# EAGLE design MainCircuit (EAGLE 6.6.0)

## Sheet 1 of 4
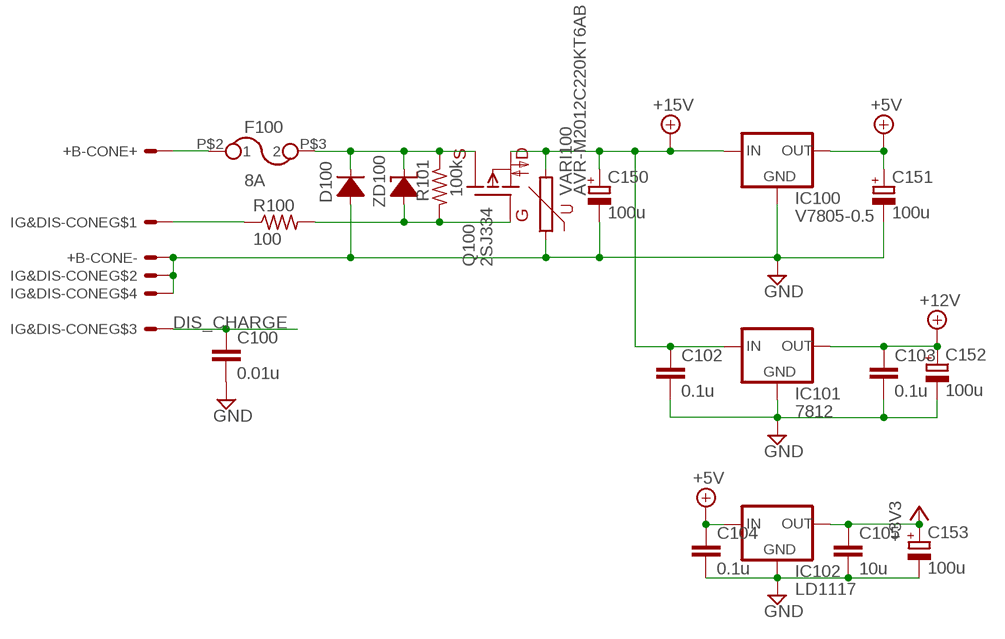
[diagram p0: schematic, sheet 1]

### Parts
+B-CONE  XT60  [XT60]
C100  0.01u  CC1608  [C1608]
C102  0.1u  CC1608  [C1608]
C103  0.1u  CC1608  [C1608]
C104  0.1u  CC1608  [C1608]
C105  10u  CC2012  [C2012]
C150  100u  CPOLE2.5-6  [E2,5-6]
C151  100u  CPOLE2.5-6  [E2,5-6]
C152  100u  CPOLE2.5-6  [E2,5-6]
C153  100u  CPOLE2.5-6  [E2,5-6]
D100  DIODEDO214  [DO214AC]
FUSE  8A  FUSE  [3216]
IC100  V7805-0.5  [V7805-0.5]
IC101  7812  78XXS  [78XXS]
IC102  LD1117  [SOT223]
IG&DIS-CONE  4B-XH-AB4B  [B4B-XH-A]
Q100  2SJ334  PCH  [TO220V]
R100  100  R-US_R1608  [R1608]
R101  100k  R-US_R1608  [R1608]
VARI100  AVR-M2012C220KT6AB  VARISTOR2012  [2012]
ZD100  ZDIODEDO214AC  [DO214AC]

### Nets
+3V3: C105.1 C153.+ IC102.2(OUT) ; also sheet 2,4
+5V: C104.1 C151.+ IC100.+VOUT(OUT) IC102.3(IN) ; also sheet 2,4
+12V: C103.1 C152.+ IC101.OUT ; also sheet 2
+15V: C102.1 C150.+ IC100.+VIN(IN) IC101.IN Q100.D VARI100.2 ; also sheet 2,3,4
DIS_CHARGE: C100.1 IG&DIS-CONE.3 ; also sheet 2
GND: +B-CONE.- C100.2 C102.2 C103.2 C104.2 C105.2 C150.- C151.- C152.- C153.- D100.A IC100.GND IC101.GND IC102.1(GND) IG&DIS-CONE.2 IG&DIS-CONE.4 VARI100.1 ; also sheet 2,3,4
N$4: IG&DIS-CONE.1 R100.1
N$11: +B-CONE.+ FUSE.P$2
N$23: D100.C FUSE.P$3 Q100.S R101.1 ZD100.C(K)
N$45: Q100.G R100.2 R101.2 ZD100.A

## Sheet 2 of 4
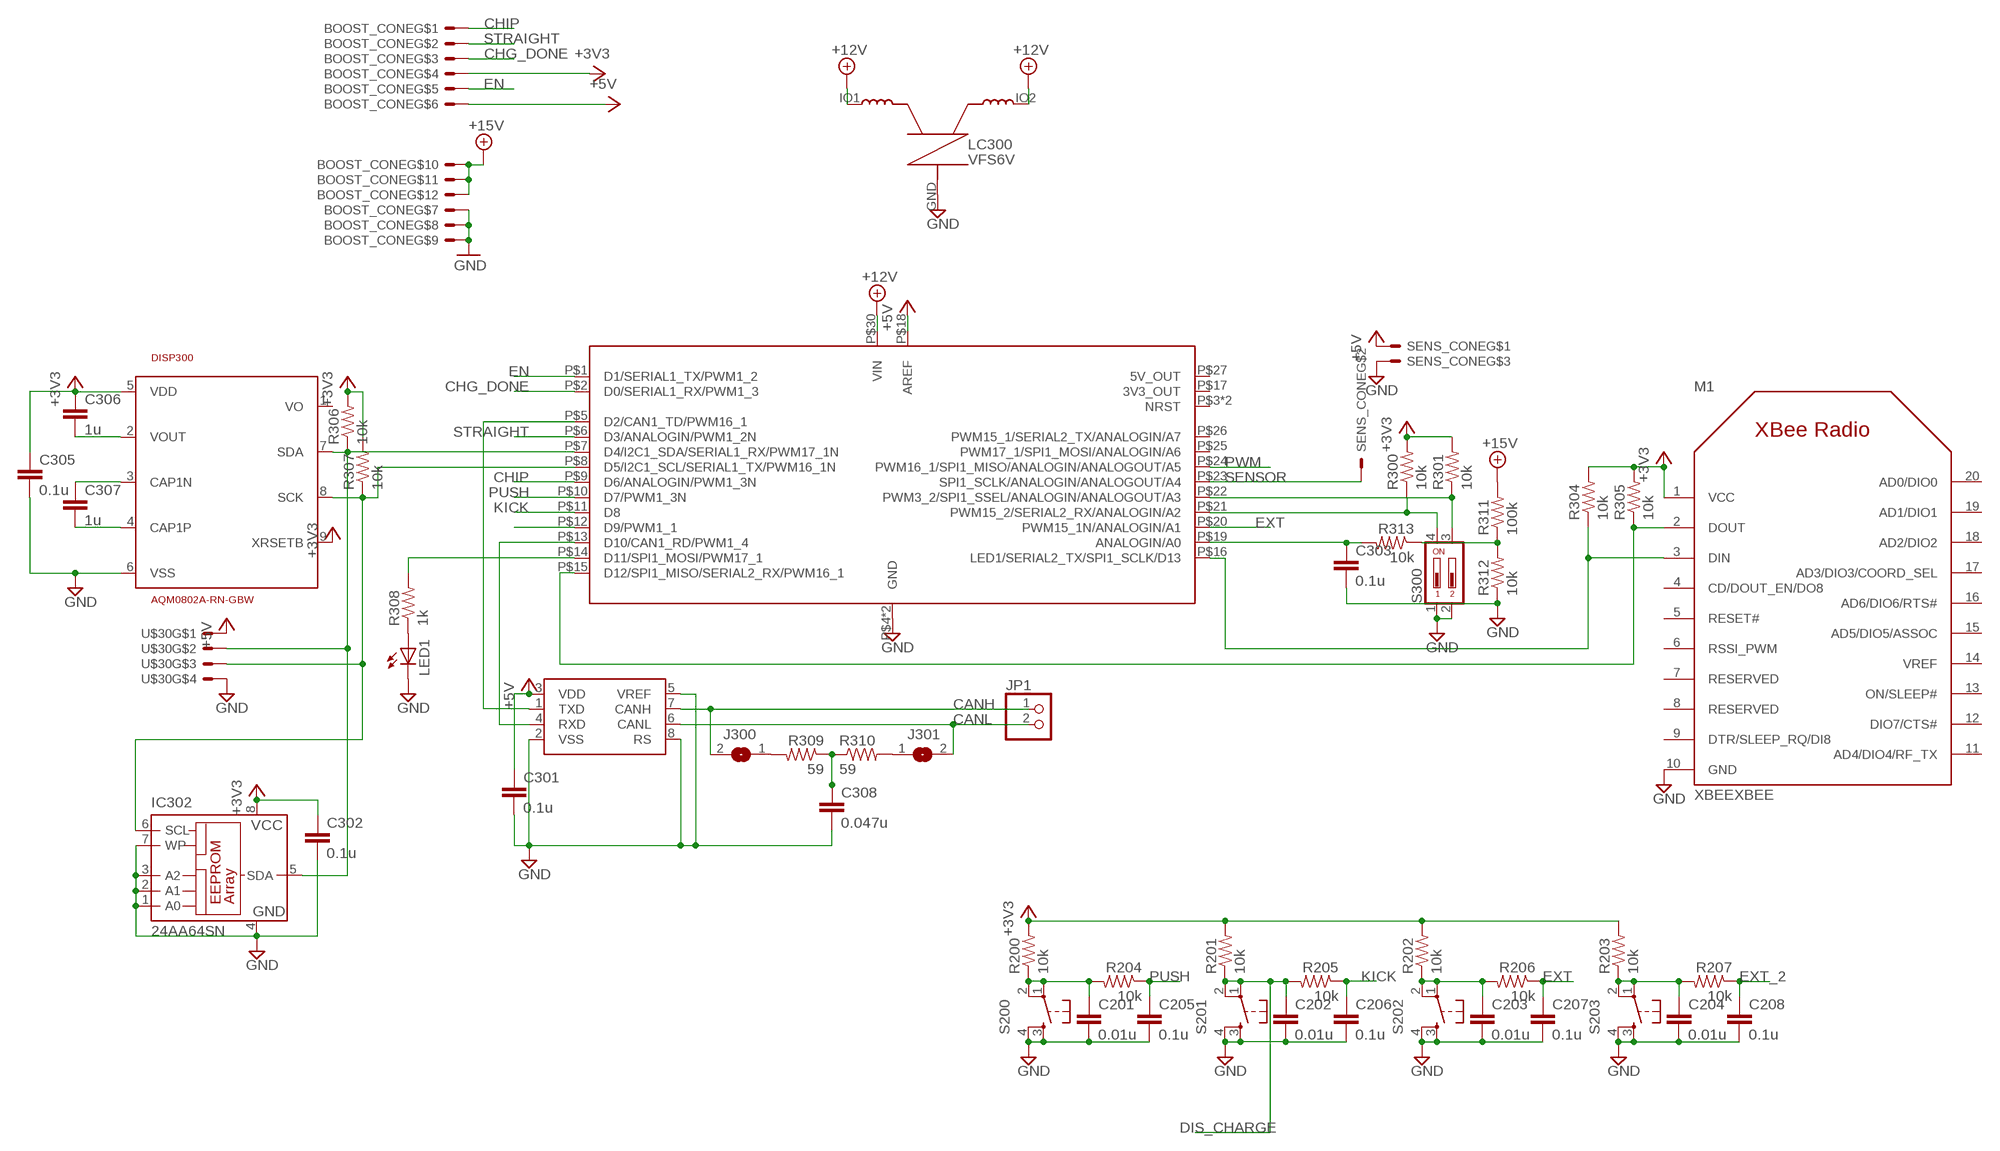
[diagram p1: schematic, sheet 2]

### Parts
BOOST_CONE  12B-XH-AB12B  [B12B-XH-A]
C201  0.01u  CC1608  [C1608]
C202  0.01u  CC1608  [C1608]
C203  0.01u  CC1608  [C1608]
C204  0.01u  CC1608  [C1608]
C205  0.1u  CC1608  [C1608]
C206  0.1u  CC1608  [C1608]
C207  0.1u  CC1608  [C1608]
C208  0.1u  CC1608  [C1608]
C301  0.1u  CC1608  [C1608]
C302  0.1u  CC1608  [C1608]
C303  0.1u  CC1608  [C1608]
C305  0.1u  CC1608  [C1608]
C306  1u  CC1608  [C1608]
C307  1u  CC1608  [C1608]
C308  0.047u  CC1608  [C1608]
DISP300  AQM0802A-RN-GBW  [AQM0802A-RN-GBW]
IC300  NUCLEO-F303K8  [NUCLEO-32]
IC301  MCP2551  [SOIC-8]
IC302  24AA64SN  [SO-08]
J300  SJ  [SJ]
J301  SJ  [SJ]
JP1  PINHD-1X2  [1X02]
LC300  VFS6V  [VFS6V]
LED1  LED3MM  [LED3MM]
M1  XBEEXBEE  [XBEE]
R200  10k  R-US_R1608  [R1608]
R201  10k  R-US_R1608  [R1608]
R202  10k  R-US_R1608  [R1608]
R203  10k  R-US_R1608  [R1608]
R204  10k  R-US_R1608  [R1608]
R205  10k  R-US_R1608  [R1608]
R206  10k  R-US_R1608  [R1608]
R207  10k  R-US_R1608  [R1608]
R300  10k  R-US_R1608  [R1608]
R301  10k  R-US_R1608  [R1608]
R304  10k  R-US_R1608  [R1608]
R305  10k  R-US_R1608  [R1608]
R306  10k  R-US_R1608  [R1608]
R307  10k  R-US_R1608  [R1608]
R308  1k  R-US_R1608  [R1608]
R309  59  R-US_R1608  [R1608]
R310  59  R-US_R1608  [R1608]
R311  100k  R-US_R1608  [R1608]
R312  10k  R-US_R1608  [R1608]
R313  10k  R-US_R1608  [R1608]
S200  T-SWITCH  [B3F-10XXS]
S201  T-SWITCH  [B3F-10XXS]
S202  T-SWITCH  [B3F-10XXS]
S203  T-SWITCH  [B3F-10XXS]
S300  DIP02YL  [DIP02YL]
SENS_CONE  3B-XH-AB3B  [B3B-XH-A]
U$30  4B-XH-AB4B  [B4B-XH-A]

### Nets
+3V3: BOOST_CONE.4 C302.1 C305.1 C306.1 DISP300.5(VDD) DISP300.9(XRSETB) IC302.8(VCC) M1.1(VCC) R200.2 R201.2 R202.2 R203.2 R300.2 R301.2 R304.2 R305.2 R306.2 R307.2 ; also sheet 1,4
+5V: BOOST_CONE.6 C301.1 IC300.P$18(AREF) IC301.3(VDD) SENS_CONE.1 U$30.1 ; also sheet 1,4
+12V: LC300.IO1 ; also sheet 1
+12V": IC300.P$30(VIN) LC300.IO2 ; supply symbol labelled +12V
+15V: BOOST_CONE.10 BOOST_CONE.11 BOOST_CONE.12 R311.2 ; also sheet 1,3,4
CANH: IC301.7(CANH) J300.2 JP1.1 ; also sheet 4
CANL: IC301.6(CANL) J301.2 JP1.2 ; also sheet 4
CHG_DONE: BOOST_CONE.3 IC300.P$2(D0/SERIAL1_RX/PWM1_3)
CHIP: BOOST_CONE.1 IC300.P$9(D6/ANALOGIN/PWM1_3N)
DIS_CHARGE: C202.1 R201.1 R205.2 S201.1(P) S201.2(P1) ; also sheet 1
EN: BOOST_CONE.5 IC300.P$1(D1/SERIAL1_TX/PWM1_2)
EXT: C207.1 IC300.P$20(PWM15_1N/ANALOGIN/A1) R206.1
EXT_2: C208.1 IC300.P$12(D9/PWM1_1) R207.1
GND: C201.2 C202.2 C203.2 C204.2 C205.2 C206.2 C207.2 C208.2 C301.2 C302.2 C303.2 C305.2 C308.2 DISP300.6(VSS) IC300.P$4(GND) IC300.P$29(GND) IC301.2(VSS) IC301.5(VREF) IC301.8(RS) IC302.1(A0) IC302.2(A1) IC302.3(A2) IC302.4(GND) IC302.7(WP) LC300.GND LED1.K(C) M1.10(GND) R312.1 S200.3(S) S200.4(S1) S201.3(S) S201.4(S1) S202.3(S) S202.4(S1) S203.3(S) S203.4(S1) S300.1 S300.2 SENS_CONE.3 U$30.4 ; also sheet 1,3,4
KICK: C206.1 IC300.P$11(D8) R205.1
N$1: C306.2 DISP300.2(VOUT)
N$5: C307.1 DISP300.3(CAP1N)
N$6: C307.2 DISP300.4(CAP1P)
N$7: C308.1 R309.1 R310.1
N$8: J300.1 R309.2
N$9: J301.1 R310.2
N$10: R311.1 R312.2 R313.1
N$12: IC300.P$22(PWM3_2/SPI1_SSEL/ANALOGIN/ANALOGOUT/A3) R301.1 S300.3
N$13: IC300.P$13(D10/CAN1_RD/PWM1_4) IC301.4(RXD)
N$14: IC300.P$5(D2/CAN1_TD/PWM16_1) IC301.1(TXD)
N$15: LED1.A R308.1
N$17: IC300.P$14(D11/SPI1_MOSI/PWM17_1) R308.2
N$18: IC300.P$15(D12/SPI1_MISO/SERIAL2_RX/PWM16_1) M1.2(DOUT) R305.1
N$19: IC300.P$16(LED1/SERIAL2_TX/SPI1_SCLK/D13) M1.3(DIN) R304.1
N$21: IC300.P$21(PWM15_2/SERIAL2_RX/ANALOGIN/A2) R300.1 S300.4
N$25: C303.1 IC300.P$19(ANALOGIN/A0) R313.2
N$38: C203.1 R202.1 R206.2 S202.1(P) S202.2(P1)
N$39: C204.1 R203.1 R207.2 S203.1(P) S203.2(P1)
N$54: C201.1 R200.1 R204.2 S200.1(P) S200.2(P1)
PGND: BOOST_CONE.7 BOOST_CONE.8 BOOST_CONE.9 ; supply symbol labelled GND ; also sheet 3,4
PUSH: C205.1 IC300.P$10(D7/PWM1_3N) R204.1
PWM: IC300.P$24(PWM16_1/SPI1_MISO/ANALOGIN/ANALOGOUT/A5) ; also sheet 3
SCK: DISP300.8(SCK) IC300.P$8(D5/I2C1_SCL/SERIAL1_TX/PWM16_1N) IC302.6(SCL) R307.1 U$30.3
SDA: DISP300.7(SDA) IC300.P$7(D4/I2C1_SDA/SERIAL1_RX/PWM17_1N) IC302.5(SDA) R306.1 U$30.2
SENSOR: IC300.P$23(SPI1_SCLK/ANALOGIN/ANALOGOUT/A4) SENS_CONE.2
STRAIGHT: BOOST_CONE.2 IC300.P$6(D3/ANALOGIN/PWM1_2N)
Unconnected: DISP300.1(VO) IC300.P$3(NRST) IC300.P$17(3V3_OUT) IC300.P$25(PWM17_1/SPI1_MOSI/ANALOGIN/A6) IC300.P$26(PWM15_1/SERIAL2_TX/ANALOGIN/A7) IC300.P$27(5V_OUT) IC300.P$28(NRST) M1.4(CD/DOUT_EN/DO8) M1.5(RESET#) M1.6(RSSI_PWM) M1.7(RESERVED) M1.8(RESERVED) M1.9(DTR/SLEEP_RQ/DI8) M1.11(AD4/DIO4/RF_TX) M1.12(DIO7/CTS#) M1.13(ON/SLEEP#) M1.14(VREF) M1.15(AD5/DIO5/ASSOC) M1.16(AD6/DIO6/RTS#) M1.17(AD3/DIO3/COORD_SEL) M1.18(AD2/DIO2) M1.19(AD1/DIO1) M1.20(AD0/DIO0)

## Sheet 3 of 4
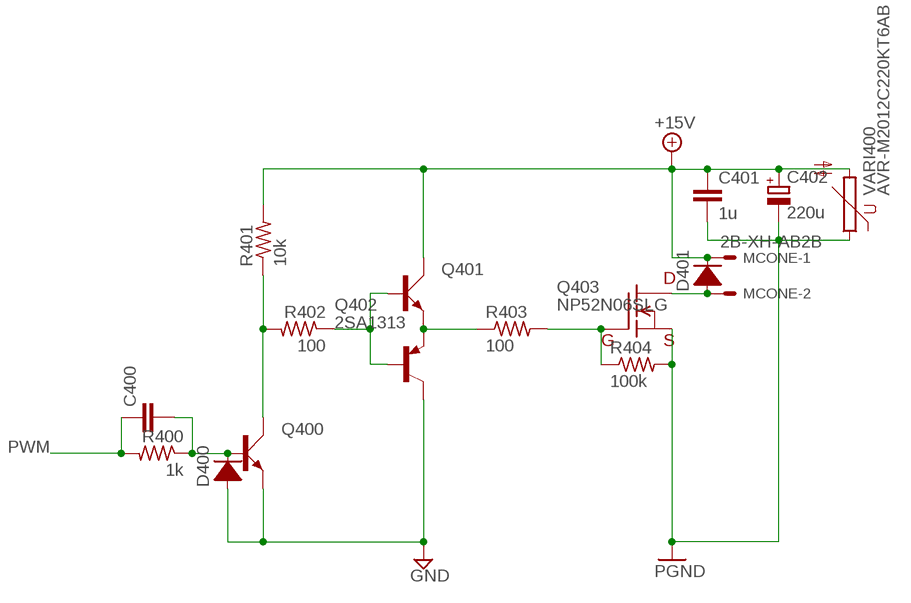
[diagram p2: schematic, sheet 3]

### Parts
C400  CC1608  [C1608]
C401  1u  CC1608  [C1608]
C402  220u  CPOLE2.5-6  [E2,5-6]
D400  DIODE1SS405  [1608]
D401  DIODEDO214  [DO214AC]
MCONE  2B-XH-AB2B  [B2B-XH-A]
Q400  2SC3325  2SC1815SOT  [SOT23]
Q401  2SC3325  2SC1815SOT  [SOT23]
Q402  2SA1313  2SA1015SOT23  [SOT23]
Q403  NP52N06SLG  IPD600N25N3  [TO-252]
R400  1k  R-US_R1608  [R1608]
R401  10k  R-US_R1608  [R1608]
R402  100  R-US_R1608  [R1608]
R403  100  R-US_R1608  [R1608]
R404  100k  R-US_R1608  [R1608]
VARI400  AVR-M2012C220KT6AB  VARISTOR2012  [2012]

### Nets
+15V: C401.1 C402.+ D401.C MCONE.1 Q401.3(C) R401.2 VARI400.2 ; also sheet 1,2,4
GND: D400.A Q400.2(E) Q402.3(C) ; also sheet 1,2,4
N$20: D401.A MCONE.2 Q403.D
N$44: Q401.2(E) Q402.2(E) R403.1
N$47: Q403.G R403.2 R404.1
N$62: Q401.1(B) Q402.1(B) R402.1
N$64: Q400.3(C) R401.1 R402.2
N$68: C400.2 D400.C Q400.1(B) R400.1
PGND: C401.2 C402.- Q403.S R404.2 VARI400.1 ; also sheet 2,4
PWM: C400.1 R400.2 ; also sheet 2

## Sheet 4 of 4
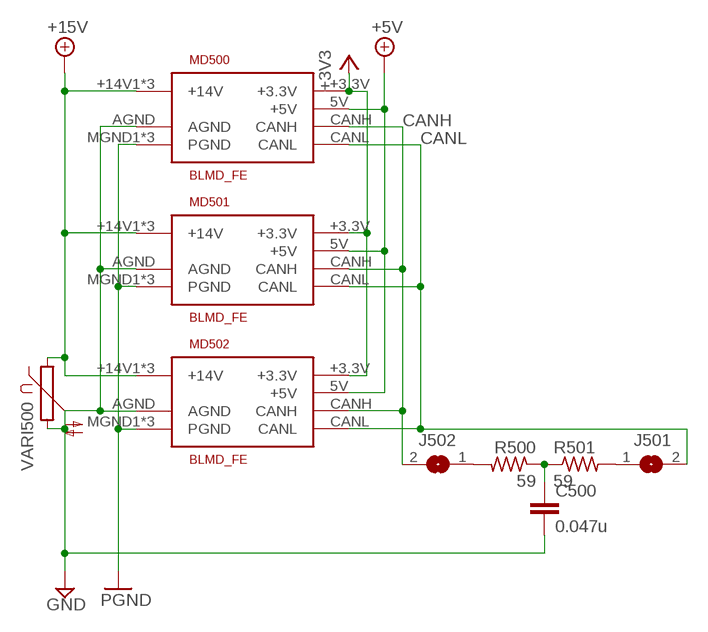
[diagram p3: schematic, sheet 4]

### Parts
C500  0.047u  CC1608  [C1608]
J501  SJ  [SJ]
J502  SJ  [SJ]
MD500  BLMD_FE  [BLMD_TE]
MD501  BLMD_FE  [BLMD_TE]
MD502  BLMD_FE  [BLMD_TE]
R500  59  R-US_R1608  [R1608]
R501  59  R-US_R1608  [R1608]
VARI500  VARISTOR2012  [2012]

### Nets
+3V3: MD500.+3.3V MD501.+3.3V MD502.+3.3V ; also sheet 1,2
+5V: MD500.5V(+5V) MD501.5V(+5V) MD502.5V(+5V) ; also sheet 1,2
+15V: MD500.+14V1(+14V) MD500.+14V2(+14V) MD500.+14V3(+14V) MD501.+14V1(+14V) MD501.+14V2(+14V) MD501.+14V3(+14V) MD502.+14V1(+14V) MD502.+14V2(+14V) MD502.+14V3(+14V) VARI500.1 ; also sheet 1,2,3
CANH: J502.2 MD500.CANH MD501.CANH MD502.CANH ; also sheet 2
CANL: J501.2 MD500.CANL MD501.CANL MD502.CANL ; also sheet 2
GND: C500.2 MD500.AGND MD501.AGND MD502.AGND VARI500.2 ; also sheet 1,2,3
N$2: C500.1 R500.1 R501.1
N$3: J502.1 R500.2
N$16: J501.1 R501.2
PGND: MD500.MGND1(PGND) MD500.MGND2(PGND) MD500.MGND3(PGND) MD501.MGND1(PGND) MD501.MGND2(PGND) MD501.MGND3(PGND) MD502.MGND1(PGND) MD502.MGND2(PGND) MD502.MGND3(PGND) ; also sheet 2,3

## Library data of the parts
+B-CONE = Con-XT:XT60
BOOST_CONE = Con-JST:*12B-XH-A
C100 C102-C105 C201-C208 C301-C303 C305-C308 C400 C401 C500 = Capacitor:C: CAPACITOR naming: grid - package width
C150-C153 C402 = CPOL:CPOL
D100 D400 D401 = Diode:DIODE: DIODE
DISP300 = LCD:AQM0802A-RN-GBW
FUSE = Fuse:FUSE; AAA: 8A; F100: aaaa
IC100 = V-reg:V7805-0.5
IC101 = V-reg:78XXS: VOLTAGE REGULATOR
IC102 = V-reg:LD1117
IC300 = ST Microelectronics Devices:NUCLEO-F303K8
IC301 = CAN:MCP2551
IC302 = microchip:24*: Serial EEPROM I2C; MF: MICROCHIP; MPN: 24AA64-I/SN; OC_FARNELL: 1331304; OC_NEWARK: 85C2288
IG&DIS-CONE U$30 = Con-JST:*4B-XH-A
J300 J301 J501 J502 = Jumper:SJ: SMD solder JUMPER
JP1 = Pinhead:PINHD-1X2: PIN HEADER
LC300 = EMI Filterlbr:VFS6V
LED1 = LED:LED: LED OSRAM: - CHIPLED LG R971, LG N971, LY N971, LG Q971, LY Q971, LO R971, LY R971 LH N974, LH R974 LS Q976, LO Q976, LY Q976 LO Q996 - Hyper CHIPLED LW Q18S LB Q993, LB Q99A, LB R99A - SideLED LS A670, LO A670, LY A670, LG A670, LP A670 LB A673, LV A673, LT A673, LW A673 LH A674 LY A675 LS A676, LA A676, LO A676, LY A676, LW A676 LS A679, LY A679, LG A679 - Hyper Micro SIDELED® LS Y876, LA Y876, LO Y876, LY Y876 LT Y87S - SmartLED LW L88C, LW L88S LB L89C, LB L89S, LG L890 LS L89K, LO L89K, LY L89K LS L896, LA L896, LO L896, LY L896 - TOPLED LS T670, LO T670, LY T670, LG T670, LP T670 LSG T670, LSP T670, LSY T670, LOP T670, LYG T670 LG T671, LOG T671, LSG T671 LB T673, LV T673, LT T673, LW T673 LH T674 LS T676, LA T676, LO T676, LY T676, LB T676, LH T676, LSB T676, LW T676 LB T67C, LV T67C, LT T67C, LS T67K, LO T67K, LY T67K, LW E67C LS E67B, LA E67B, LO E67B, LY E67B, LB E67C, LV E67C, LT E67C LW T67C LS T679, LY T679, LG T679 LS T770, LO T770, LY T770, LG T770, LP T770 LB T773, LV T773, LT T773, LW T773 LH T774 LS E675, LA E675, LY E675, LS T675 LS T776, LA T776, LO T776, LY T776, LB T776 LHGB T686 LT T68C, LB T68C - Hyper Mini TOPLED® LB M676 - Mini TOPLED Santana® LG M470 LS M47K, LO M47K, LY M47K Source: http://www.osram.convergy.de/
M1 = Xbee:XBEE
MCONE = Con-JST:*2B-XH-A: .100" (2.54mm) Center Header - 2 Pin; MF: MOLEX; MPN: 22-23-2021; OC_FARNELL: 1462926; OC_NEWARK: 25C3832
MD500-MD502 = BrushlessMotorDriver:BLMD_FE
Q100 = MOSFET:PCH
Q400 Q401 = Transistor_NPN:2SC1815: NPN TRANSISTOR
Q402 = Transistor_PNP:2SA1015: PNP Transistor
Q403 = MOSFET:IPD600N25N3
R100 R101 R200-R207 R300 R301 R304-R313 R400-R404 R500 R501 = Registor:R-US_: RESISTOR, American symbol
S200-S203 = Switch:T-SWITCH: TACTILE SWITCH
S300 = Switch-dil:DIP02YL: DIL/CODE SWITCH
SENS_CONE = Con-JST:*3B-XH-A
VARI100 VARI400 VARI500 = Varistor:VARISTOR: VARISTOR
ZD100 = Diode:ZDIODE: ZENER DIODE

## Board
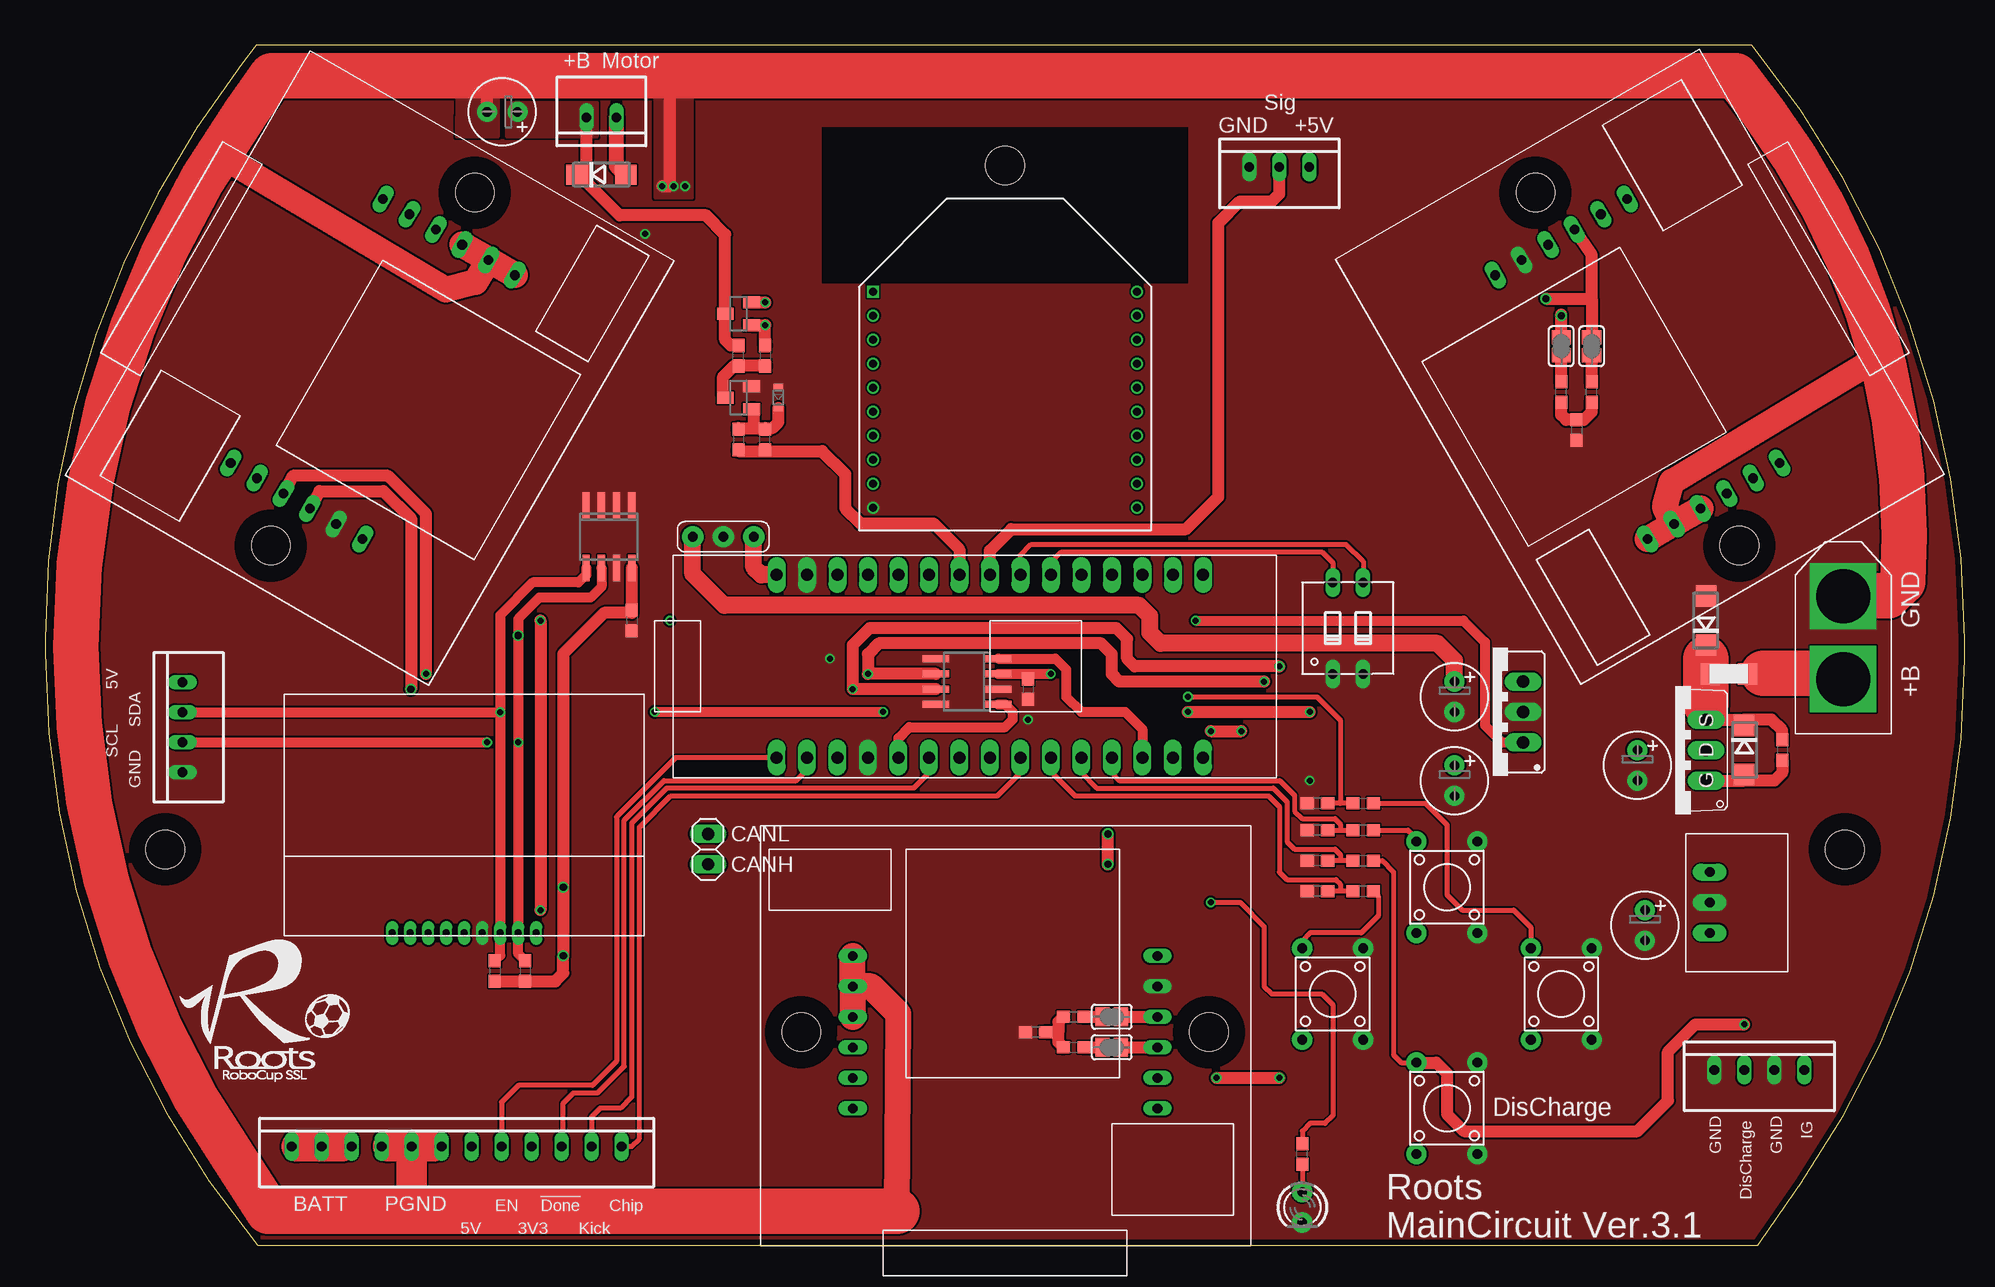
[diagram p4: board, top side]
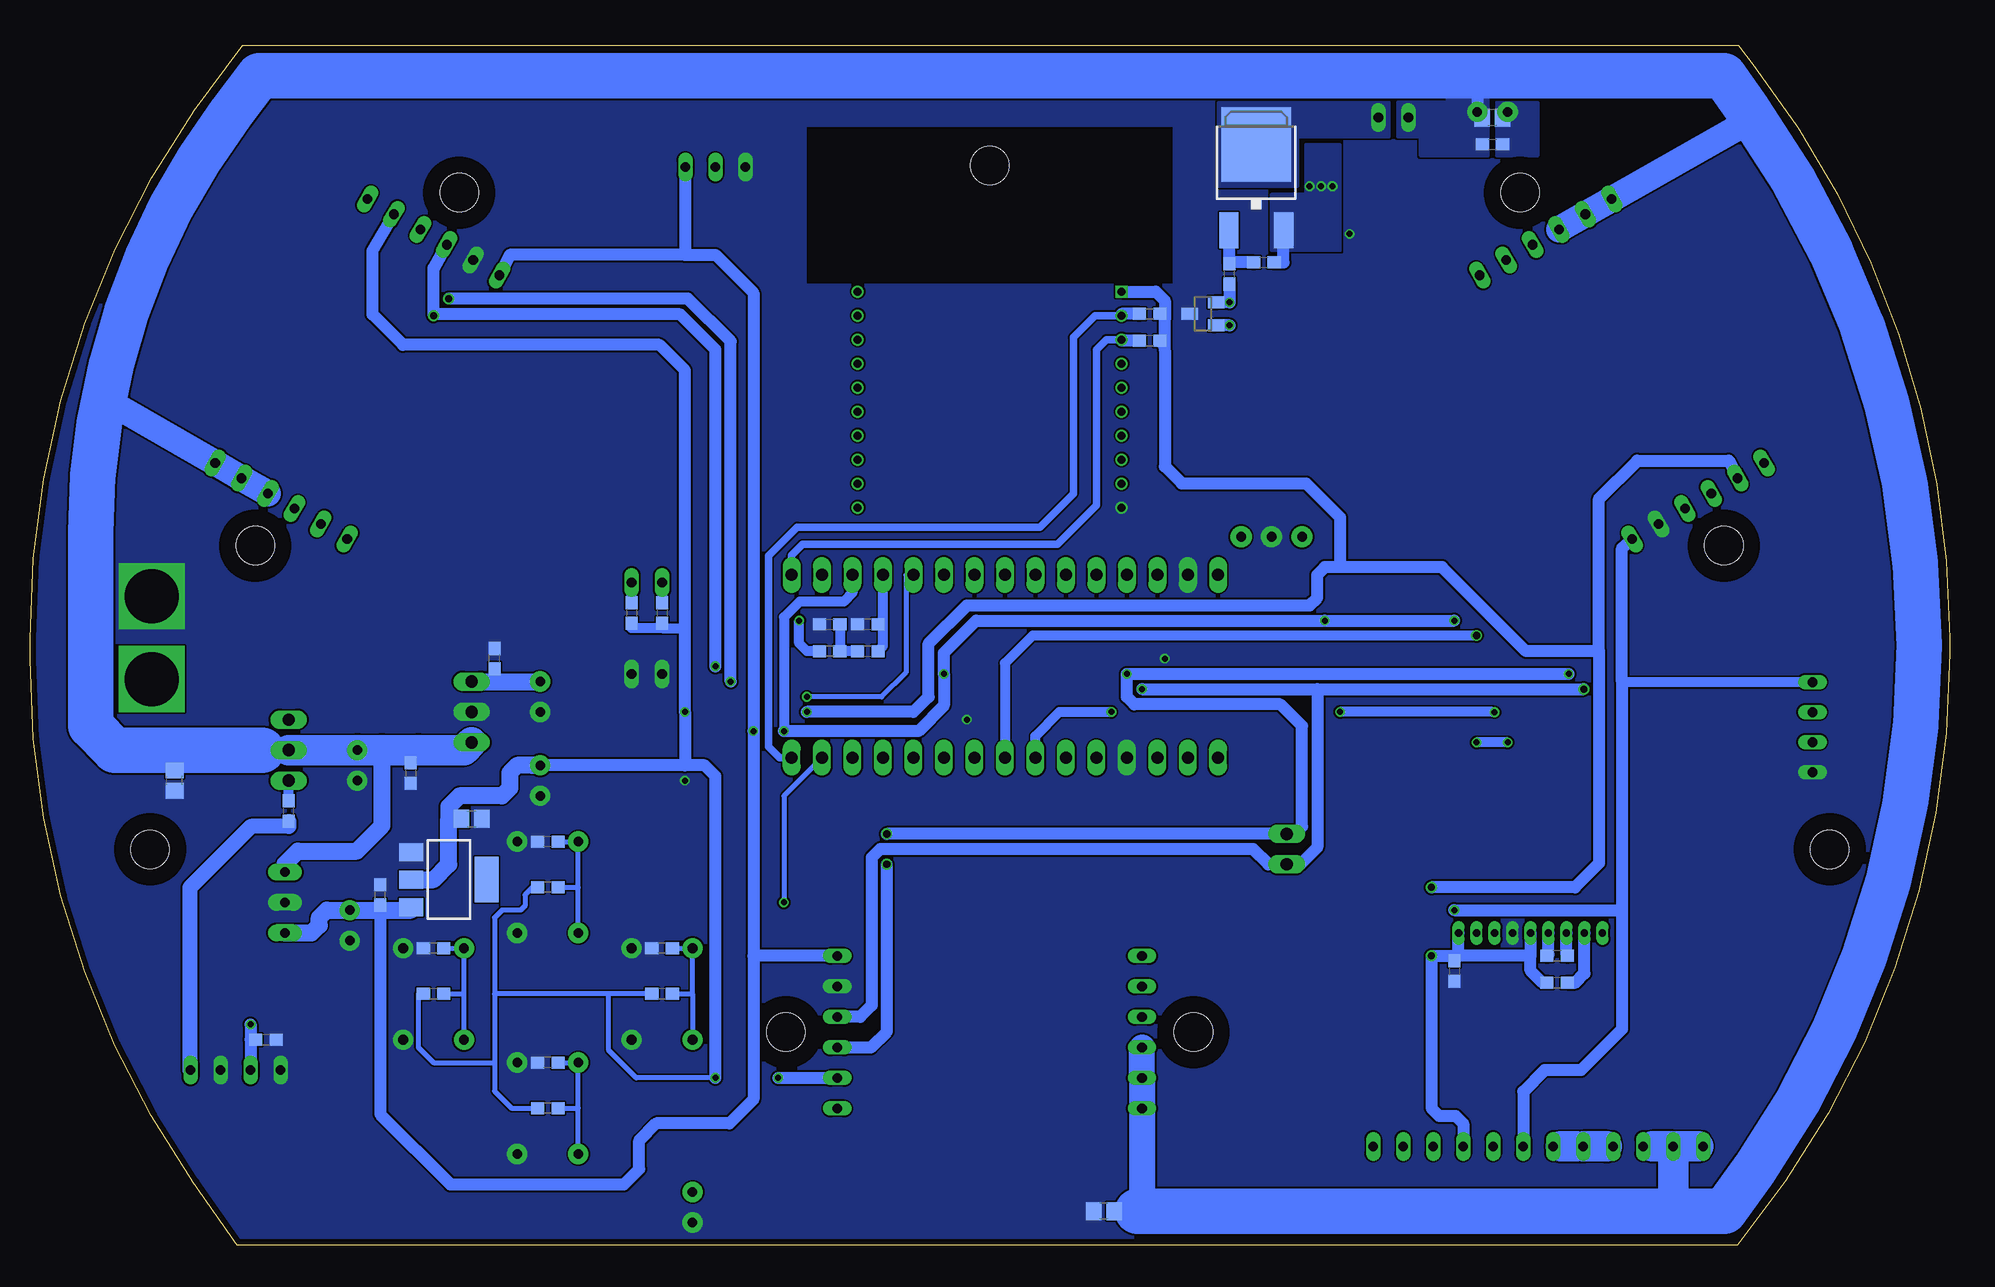
[diagram p5: board, bottom side, seen from below]

Size 160 x 100 mm. Coordinates in mm from the lower left corner, seen from the top.
Outline: 0,50.6 0,49.34 arc39 17.69,0 142.75,0 146.35,5.2 arc35 160,48.83 160,50.52 arc39 142.25,100 17.61,100 16.38,98.42 arc38 0,50.6
Copper layers (1*16): Top 0.035mm / dielectric 1.6mm / Bottom 0.035mm
Design rules "Elecrow_2-layer_PCB_eagle_rule": minimum track width 6mil, minimum drill 12mil, track to track 6mil, track to pad 6mil, pad to pad 6mil, via to via 8mil, smd to smd 0mil, copper to edge 20mil, drill to drill 10mil, minimum pad ring 6mil, minimum via ring 6mil, stop-mask expansion 0mil, vias tented up to drill 100mil, thermal gap 10mil
Holes 3.2 mm at 80,90 10,33 150,33
tRestrict: area 77,87 to 83,93; area 7,30 to 13,36; area 147,30 to 153,36; area 64.8,80.2 to 95.2,93.2
bRestrict: area 77,87 to 83,93; area 7,30 to 13,36; area 147,30 to 153,36; area 64.8,80.2 to 95.2,93.2

### Footprints (pad centres in the part's own frame; a part is rotated, then mirrored left to right if it is on the bottom)
XT60 = drill 4.5 square: + -3.45,0; - 3.45,0
B12B-XH-A = drill 0.8 long: 1 -13.75,0; 2 -11.25,0; 3 -8.75,0; 4 -6.25,0; 5 -3.75,0; 6 -1.25,0; 7 1.25,0; 8 3.75,0; 9 6.25,0; 10 8.75,0; 11 11.25,0; 12 13.75,0
C1608 = smd 1.1 x 1: 1 -0.85,0; 2 0.85,0
C2012 = smd 1.3 x 1.5: 1 -0.85,0; 2 0.85,0
E2,5-6 = drill 0.8 pad 1.676: + -1.27,0; - 1.27,0
DO214AC = smd 1.8 x 1.7: A 2.05,0; C -2.05,0
1608 = smd 0.6 x 0.8: A 0.85,0; C -0.85,0
AQM0802A-RN-GBW = drill 0.6 pad 1.016 long: 1 -6,-10.16; 2 -4.5,-10.16; 3 -3,-10.16; 4 -1.5,-10.16; 5 0,-10.16; 6 1.5,-10.16; 7 3,-10.16; 8 4.5,-10.16; 9 6,-10.16
3216 = smd 1.57 x 1.78: P$2 -1.55,0; P$3 1.55,0
V7805-0.5 = drill 0.8 pad 1.422 long: +VIN -2.54,-2.54; +VOUT 2.54,-2.54; GND 0,-2.54
78XXS = drill 1.016 long: GND 0,-2.54; IN -2.54,-2.54; OUT 2.54,-2.54
SOT223 = smd 1.5 x 2: 1 -2.3,-3.15; 2 0,-3.15; 3 2.3,-3.15 | smd 3.8 x 2: 4 0,3.15
NUCLEO-32 = drill 1 long: P$1 -7.62,19.05; P$2 -7.62,16.51; P$3 -7.62,13.97; P$4 -7.62,11.43; P$5 -7.62,8.89; P$6 -7.62,6.35; P$7 -7.62,3.81; P$8 -7.62,1.27; P$9 -7.62,-1.27; P$10 -7.62,-3.81; P$11 -7.62,-6.35; P$12 -7.62,-8.89; P$13 -7.62,-11.43; P$14 -7.62,-13.97; P$15 -7.62,-16.51; P$16 7.62,-16.51; P$17 7.62,-13.97; P$18 7.62,-11.43; P$19 7.62,-8.89; P$20 7.62,-6.35; P$21 7.62,-3.81; P$22 7.62,-1.27; P$23 7.62,1.27; P$24 7.62,3.81; P$25 7.62,6.35; P$26 7.62,8.89; P$27 7.62,11.43; P$28 7.62,13.97; P$29 7.62,16.51; P$30 7.62,19.05
SOIC-8 = smd 0.6 x 2.2: 1 -1.905,-2.6; 2 -0.635,-2.6; 3 0.635,-2.6; 4 1.905,-2.6; 5 1.905,2.6; 6 0.635,2.6; 7 -0.635,2.6; 8 -1.905,2.6
SO-08 = smd 0.6 x 2.2: 1 -1.905,-2.6; 2 -0.635,-2.6; 3 0.635,-2.6; 4 1.905,-2.6; 5 1.905,2.6; 6 0.635,2.6; 7 -0.635,2.6; 8 -1.905,2.6
B4B-XH-A = drill 0.8 long: 1 -3.75,0; 2 -1.25,0; 3 1.25,0; 4 3.75,0
SJ = smd 1.168 x 1.6: 1 -0.762,0; 2 0.762,0
1X02 = drill 1.016 long: 1 -1.27,0; 2 1.27,0
VFS6V = drill 0.8 pad 1.778: GND 0,0; IO1 -2.54,0; IO2 2.54,0
LED3MM = drill 0.8 pad 1.676: A -1.27,0; K 1.27,0
XBEE = drill 0.66 square: 1 -11,9 | drill 0.66: 2 -11,7; 3 -11,5; 4 -11,3; 5 -11,1; 6 -11,-1; 7 -11,-3; 8 -11,-5; 9 -11,-7; 10 -11,-9; 11 11,-9; 12 11,-7; 13 11,-5; 14 11,-3; 15 11,-1; 16 11,1; 17 11,3; 18 11,5; 19 11,7; 20 11,9
B2B-XH-A = drill 0.8 long: 1 -1.25,0; 2 1.25,0
BLMD_TE = drill 0.8 long: 5V 12.7,6.35; +3.3V 12.7,-3.81; +12V 12.7,-6.35; +14V1 -12.7,-6.35; +14V2 -12.7,-3.81; +14V3 -12.7,-1.27; AGND 12.7,3.81; CANH 12.7,1.27; CANL 12.7,-1.27; MGND1 -12.7,1.27; MGND2 -12.7,3.81; MGND3 -12.7,6.35 | hole 3.2: -16.99,0; 16.99,0
TO220V = drill 1.016 long: D 0,-2.54; G -2.54,-2.54; S 2.54,-2.54
SOT23 = smd 1 x 1.4: 1 -0.95,-1.1; 2 0.95,-1.1; 3 0,1.1
TO-252 = smd 5.8 x 6.2: D 0,2.38 | smd 1.6 x 3: G -2.28,-4.8; S 2.28,-4.8
R1608 = smd 1.1 x 1: 1 -0.85,0; 2 0.85,0
B3F-10XXS = drill 0.813 pad 1.676: 1 -3.81,2.54; 2 3.81,2.54; 3 -3.81,-2.54; 4 3.81,-2.54
DIP02YL = drill 0.813 long: 1 -1.27,-3.81; 2 1.27,-3.81; 3 1.27,3.81; 4 -1.27,3.81
B3B-XH-A = drill 0.8 long: 1 -2.5,0; 2 0,0; 3 2.5,0
2012 = smd 1.3 x 1.5: 1 -0.85,0; 2 0.85,0

### Placement (x,y rotation side)
+B-CONE  149.86,50.64 90 top
BOOST_CONE  34.29,8.26 180 top
C100  140.34,17.14 0 bottom
C102  128.27,39.37 270 bottom
C103  121.28,48.9 90 bottom
C104  130.81,29.21 90 bottom
C105  123.19,35.56 0 bottom
C150  132.72,40.01 270 top
C151  133.35,26.67 270 top
C152  117.47,45.72 270 top
C153  117.47,38.73 270 top
C201  107.31,24.77 180 bottom
C202  116.84,15.24 180 bottom
C203  126.36,24.77 180 bottom
C204  116.84,33.66 180 bottom
C205  106.05,29.53 180 top
C206  106.05,32.07 180 top
C207  106.05,36.83 180 top
C208  106.05,34.61 180 top
C301  81.92,46.35 270 top
C302  48.9,52.07 270 top
C303  90.17,51.75 180 bottom
C305  41.27,22.86 270 bottom
C306  32.7,21.91 0 bottom
C307  32.7,24.13 180 bottom
C308  127.64,67.94 270 top
C400  60.01,67.15 90 top
C401  38.1,91.76 0 bottom
C402  38.1,94.46 180 top
C500  82.55,17.78 180 top
D100  138.43,52.07 90 top
D400  61.12,70.64 90 top
D401  46.35,89.22 0 top
DISP300  34.92,36.2 0 top
FUSE  140.34,47.62 180 top
IC100  141.29,28.57 270 top
IC101  120.65,44.45 90 top
IC102  125.09,30.48 270 bottom
IC300  80.01,48.26 90 top
IC301  76.83,46.99 90 top
IC302  46.99,59.05 180 top
IG&DIS-CONE  142.88,14.61 180 top
J300  126.36,74.93 90 top
J301  128.91,74.93 90 top
J501  88.9,16.51 0 top
J502  88.9,19.05 0 top
JP1  55.24,33.02 90 top
LC300  56.52,59.05 0 top
LED1  104.78,3.17 270 top
M1  80.01,70.48 0 top
MCONE  46.35,93.98 0 top
MD500  80.01,17.77 0 top
MD501  27.3,73.03 240 top
MD502  132.72,73.03 120 top
Q100  135.89,41.27 90 top
Q400  57.78,70.64 90 top
Q401  57.78,77.63 90 top
Q402  62.23,77.63 90 bottom
Q403  57.78,89.38 0 bottom
R100  138.43,36.2 90 bottom
R101  144.78,41.27 270 top
R200  107.31,20.95 180 bottom
R201  116.84,11.43 180 bottom
R202  126.36,20.95 180 bottom
R203  116.84,29.84 180 bottom
R204  109.86,29.53 0 top
R205  109.86,32.07 0 top
R206  109.86,36.83 0 top
R207  109.86,34.61 0 top
R300  107.31,52.7 270 bottom
R301  109.86,52.7 270 bottom
R304  66.67,75.41 0 bottom
R305  66.67,77.63 0 bottom
R306  37.47,22.86 270 top
R307  40.01,22.86 270 top
R308  104.78,7.62 90 top
R309  126.36,71.12 90 top
R310  128.91,71.12 90 top
R311  93.34,49.53 180 bottom
R312  93.34,51.75 0 bottom
R313  90.17,49.53 0 bottom
R400  57.78,67.15 270 top
R401  57.78,74.14 90 top
R402  60.01,74.14 270 top
R403  60.01,80.96 90 bottom
R404  57.15,81.92 0 bottom
R500  85.72,19.05 0 top
R501  85.72,16.51 0 top
S200  107.31,20.95 90 top
S201  116.84,11.43 90 top
S202  126.36,20.95 90 top
S203  116.84,29.84 90 top
S300  108.58,51.44 0 top
SENS_CONE  102.87,89.85 180 top
U$30  11.43,43.18 270 top
U$106  [ROOTS]  10.79,12.06 0 top
VARI100  147.96,38.73 90 bottom
VARI400  38.1,93.98 180 bottom
VARI500  70.48,2.86 180 bottom
ZD100  141.6,41.27 270 top

### Tracks (layer width: path | path; a pad name or v marks a point on that pad's centre or on a via)
+3V3  (via drill 0.5, 0.6)
  Top 0.813: 48.9,52.7 C302.1
  Top 1.016: R306.2 R307.2 42.51,22.01 43.18,22.68 v43.18,24.13 v43.18,29.84 43.18,49.28 46.6,52.7 48.9,52.7 | v97.63,13.97 v102.87,13.97 | v95.25,44.45 v105.41,44.45 | IC302.8 C302.1
  Bottom 0.406: R203.2 118.11,29.84 118.75,29.21 118.75,28.3 119.1,27.94 120.65,27.94 121.28,27.3 121.28,20.95 | R200.2 111.76,20.95 | 111.76,20.95 121.28,20.95 | 121.28,20.95 121.28,15.24 | 121.28,15.24 121.28,12.85 119.86,11.43 R201.2 | R202.2 127.64,20.95 127.64,16.51 126.36,15.24 121.28,15.24 | v102.87,13.97 109.47,13.97 111.76,16.26 111.76,20.95
  Bottom 0.813: R305.2 65.41,77.15 | R304.2 65.41,74.61 | R300.2 107.31,51.44 | 107.31,51.44 109.86,51.44 R301.2 | 107.31,51.44 105.41,51.44
  Bottom 1.016: 65.41,77.87 65.41,77.15 65.41,74.61 65.41,64.92 63.98,63.5 53.64,63.5 50.8,60.66 50.8,56.52 | 40.92,24.13 DISP300.9 | BOOST_CONE.4 40.54,10.15 41.18,10.79 42.55,10.79 43.18,11.43 v43.18,24.13 41.27,24.13 | 41.27,24.13 40.92,24.13 | 34.92,24.13 40.92,24.13 | DISP300.5 34.92,24.13 | C305.1 41.27,24.13 | C306.1 33.93,21.91 34.92,22.9 34.92,24.13 | 50.8,56.52 52.07,56.52 52.7,55.88 52.7,53.98 53.34,53.34 81.92,53.34 85.09,50.16 85.09,45.72 86.36,44.45 v95.25,44.45 | v102.87,13.97 102.87,39.11 103.77,40.01 105.41,40.01 | 105.41,40.01 118.11,40.01 | M1.1 66.15,79.48 65.41,78.74 65.41,77.63 R305.2 | 29.21,49.53 35.31,49.53 42.29,56.52 50.8,56.52 | 105.41,40.01 v105.41,44.45 105.41,51.44 105.41,72.93 107.52,75.04 128.9,75.04 131.44,77.58 131.44,82.87 MD502.+3.3V | 29.21,49.53 29.21,31.85 31.22,29.84 v43.18,29.84 | v97.63,13.97 MD500.+3.3V | 29.21,49.53 29.21,62.23 26.04,65.41 18.41,65.41 MD501.+3.3V
  Bottom 1.27: C105.1 125.09,35.56
  Bottom 1.422: IC102.2 126.36,30.48 125.09,31.75 125.09,35.56 125.09,36.57 124.2,37.47 120.65,37.47 120.02,38.1 120.02,39.37 119.38,40.01 118.11,40.01 C153.+
+5V  (via drill 0.5)
  Top 0.813: IC301.3 81.92,47.62 | 81.92,47.62 v83.82,47.62 | C301.1 81.92,47.62
  Top 1.016: v97.16,42.86 v99.69,42.86 | v41.27,52.07 v41.27,27.94
  Bottom 0.813: U$30.1 27.3,46.93 27.3,46.99 | IC300.P$18 91.44,54.37 92.15,53.66 95.85,53.66 97.16,52.35 v97.16,42.86
  Bottom 1.016: 27.3,27.94 27.3,46.99 27.3,58.1 MD501.5V | 27.3,27.94 27.3,18.02 30.73,14.61 33.76,14.61 35.54,12.82 BOOST_CONE.6 | 130.81,27.94 C104.1 130.81,10.93 124.96,5.08 110.49,5.08 109.22,6.35 109.22,8.74 107.8,10.16 101.7,10.16 99.69,12.17 99.69,24.12 | v97.16,42.86 85.95,42.86 83.82,44.99 v83.82,47.62 83.82,49.38 81.13,52.07 v52.07,52.07 v41.27,52.07 | 99.69,24.12 v99.69,42.86 99.69,79.38 102.87,82.55 105.41,82.55 | SENS_CONE.1 105.41,89.85 105.41,82.55 | v41.27,27.94 27.3,27.94 | MD500.5V 99.69,24.12 | 105.41,82.55 120.02,82.55 MD502.5V
  Bottom 1.422: IC100.+VOUT 136.53,26.04 135.89,26.67 135.89,27.3 135.25,27.94 C151.+ 130.81,27.94 128.25,27.94 IC102.3
+12V
  Top 1.422: C152.+ 117.47,48.74 116.06,50.16 92.97,50.16 92.08,51.06 92.08,52.44 91.18,53.34 56.59,53.34 53.98,55.96 LC300.IO1
  Bottom 0.813: C103.1 121.28,46.99
  Bottom 1.422: IC101.OUT 121.28,46.99 C152.+
+12V"
  Top 1.422: IC300.P$30 59.69,55.88 59.05,56.52 LC300.IO2
+15V  (via drill 0.5)
  Top 0.61: D401.C 45.1,89.22 45.1,89.53
  Top 0.813: v95.89,52.07 118.22,52.07 120.02,50.27 120.02,43.33 121.44,41.91 IC101.IN
  Top 1.016: BOOST_CONE.12 20.95,8.26 | BOOST_CONE.10 24.77,8.26 | Q401.3 56.52,77.63 | R401.2 57.15,74.99 56.69,75.45 Q401.3 | 45.15,93.98 MCONE.1 45.1,89.53 45.1,88.61 47.88,85.83 55.09,85.83 56.69,84.24 Q401.3
  Top 2.54: 20.95,8.26 BOOST_CONE.11 24.77,8.26
  Bottom 0.813: R311.2 95.25,49.53 95.89,50.16 v95.89,52.07
  Bottom 1.016: Q100.D 140.65,41.27 | C102.1 127.64,41.27 | VARI100.2 147.96,41.27 | 34.29,97.79 39.37,97.79 C402.+ | VARI500.1 67.67,2.86
  Bottom 1.422: IC100.+VIN 138.75,31.8 137.68,32.86 132.77,32.86 130.65,34.98 130.65,41.27
  Bottom 1.93: 67.67,2.86 67.94,3.17 | 16.19,93.98 16.73,94.53 | 154.94,59.41 153.67,70.48
  Bottom 2.184: 16.19,93.98 MD501.+14V3 MD501.+14V2 MD501.+14V1 | MD500.+14V3 MD500.+14V2 MD500.+14V1 67.31,2.86 | 153.67,70.48 MD502.+14V1 MD502.+14V2 MD502.+14V3
  Bottom 2.54: BOOST_CONE.11 24.77,8.26 | BOOST_CONE.11 20.95,8.26 | 23.18,2.86 arc-90 23.04,2.36 BOOST_CONE.11 | Q100.D C150.+ 130.65,41.27 127.64,41.27 123.83,41.27 IC101.IN | 34.29,97.79 34.29,97.47
  Bottom 3.81: 140.65,41.27 147.96,41.27 152.93,41.27 154.94,43.28 154.94,59.41 arc37 143.25,94.37 140.91,97.47 34.29,97.47 18.81,97.47 16.73,94.53 arc35 2.54,50.02 arc35 16.18,6.43 18.78,2.86 23.18,2.86 67.31,2.86 67.67,2.86
  pour Bottom (no thermals): 46.04,92.39 44.13,92.39 44.13,90.81 38.42,90.81 38.42,96.52 41.91,96.52 41.91,95.25 46.04,95.25
  pour Top (no thermals): 46.04,95.25 38.42,95.25 38.42,92.39 46.04,92.39
CANH  (via drill 0.5, 0.6)  (1 unrouted)
  Top 1.016: IC301.7 v67.31,46.35 67.31,50.02 68.73,51.44 89.27,51.44 90.17,50.54 90.17,48.9 90.81,48.26 v102.87,48.26 | MD501.CANH 22.86,62.87 28.19,62.87 30.48,60.58 v30.48,46.35 | J502.2 MD500.CANH | J300.2 v126.36,77.47 126.36,77.58
  Bottom 1.016: v67.31,46.35 52.7,46.35 | 52.7,46.35 52.7,33.17 54.12,31.75 JP1.1 56.78,31.75 58.05,33.02 89.14,33.02 89.85,32.31 89.85,19.99 90.81,19.04 MD500.CANH | v102.87,48.26 102.87,74.64 105.81,77.58 126.36,77.58 126.36,81.44 MD502.CANH | 52.7,46.35 v30.48,46.35
CANL  (via drill 0.5, 0.6)
  Top 1.016: IC301.6 v68.58,47.62 68.58,49.27 69.48,50.16 88,50.16 88.9,49.27 88.9,47.62 89.53,46.99 v101.6,46.99 | v88.58,31.75 v88.58,34.29 | v125.09,78.9 128.91,78.9 | MD502.CANL 128.91,82.55 128.91,78.9 | v31.75,47.62 31.75,60.96 28.57,64.14 20.64,64.14 MD501.CANL | J501.2 MD500.CANL | 128.82,75.69 J301.2 128.91,78.9
  Bottom 1.016: v88.58,34.29 JP1.2 54.61,34.29 53.98,34.92 53.98,43.29 55.77,45.09 67.94,45.09 68.58,45.72 v68.58,47.62 v31.75,47.62 | v101.6,46.99 101.6,75.33 105.17,78.9 v125.09,78.9 | MD500.CANL 89.9,16.5 88.58,17.82 v88.58,31.75
CHG_DONE
  Top 0.406: BOOST_CONE.3 43.18,8.26 43.18,11.85 44.03,12.7 46.03,12.7 48.26,14.93 48.26,35.43 51.56,38.73 62.6,38.73 63.5,39.63 IC300.P$2
CHIP
  Top 0.406: BOOST_CONE.1 48.9,8.26 49.53,8.89 49.53,34.86 52.13,37.47 79.38,37.47 81.28,39.37 IC300.P$9
DIS_CHARGE  (via drill 0.5)
  Top 0.406: R205.2 111.44,32.07 112.39,31.11 112.39,15.88 113.03,15.24 S201.2
  Top 1.016: S201.2 115.94,15.24 116.84,14.34 116.84,10.95 118.26,9.53 132.72,9.53 135.25,12.06 135.25,16.12 137.54,18.41 v141.6,18.41
  Bottom 0.406: S201.1 114.3,11.43 | 114.3,11.43 S201.2 C202.1 | R201.1 114.3,11.43
  Bottom 1.016: v141.6,18.41 141.62,18.41 141.62,17.14 | 141.62,17.14 IG&DIS-CONE.3 | C100.1 141.62,17.14
EN
  Top 0.406: IC300.P$1 52.56,40.64 47.62,35.71 47.62,15.34 45.62,13.34 39.44,13.34 38.04,11.93 BOOST_CONE.5
EXT  (via drill 0.5)
  Top 0.406: R206.1 107.95,36.83 | 107.95,36.83 C207.1 | v95.25,45.72 106.01,45.72 107.95,43.78 107.95,36.83
  Bottom 0.406: IC300.P$20 87,55.88 87,47.73 89,45.72 v95.25,45.72
EXT_2
  Top 0.406: 107.95,34.61 107.95,35.11 107.5,35.56 104.78,35.56 104.14,36.2 104.14,37.49 102.9,38.73 89.53,38.73 88.9,39.37 IC300.P$12 | C208.1 107.95,34.61 | 107.95,34.61 R207.1
GND  (via drill 0.5)
  other vias: 50.01,84.3 105.41,38.73 81.92,43.81 65.41,48.9
  pour Bottom (rank 6, no thermals): 160.02,100.33 0,100.33 0,0 160.66,0
  pour Top (rank 6, no thermals): 0,100.33 0,0 160.66,0 160.02,100.33
KICK
  Top 0.406: R205.1 107.95,32.07 | 107.95,32.07 C206.1 | IC300.P$11 86.36,39.37 87.63,38.1 102.36,38.1 103.5,36.95 103.5,33.66 104.14,33.02 107.5,33.02 107.95,32.57 107.95,32.07
N$1
  Bottom 1.016: C306.2 31.18,21.91 30.43,22.67 DISP300.2
N$2
  Top 1.016: C500.1 84.45,17.78 | R500.1 84.45,18.63 84.45,17.78 | R501.1 84.45,16.93 84.45,17.78
N$3
  Top 1.016: R500.2 J502.1
N$4
  Bottom 1.27: R100.1 138.43,34.92 141.56,34.92 146.69,29.8 146.69,14.61 IG&DIS-CONE.1
N$5
  Bottom 1.016: C307.1 31.93,24.2 DISP300.3
N$6
  Bottom 1.016: C307.2 33.42,24.26 DISP300.4
N$7
  Top 1.016: R309.1 126.36,69.22 126.78,68.8 C308.1 128.24,68.8 128.91,69.47 R310.1
N$8
  Top 1.016: R309.2 J300.1
N$9
  Top 1.016: R310.2 J301.1
N$10
  Bottom 0.813: R313.1 R311.1 R312.2
N$11
  Top 1.016: FUSE.P$2 143.19,47.62 143.19,47.67
  Top 3.81: +B-CONE.+ 149.86,47.67 143.19,47.67
N$12
  Top 0.406: IC300.P$22 81.28,57.52 82.18,58.42 108.44,58.42 109.86,57 S300.3
  Bottom 0.813: R301.1 S300.3
N$13
  Top 0.813: IC301.4 84.19,48.9 85.09,48 85.09,45.72 86.36,44.45 90.02,44.45 91.44,43.03 IC300.P$13
N$14
  Top 0.813: IC300.P$5 71.12,42.28 72.02,43.18 80.01,43.18 80.64,43.81 80.64,44.45 80.01,45.09 IC301.1
N$15
  Top 0.406: R308.1 LED1.A
N$16
  Top 1.016: R501.2 J501.1
N$17  (via drill 0.5)
  Top 0.406: v97.16,28.57 99.59,28.57 101.6,26.57 101.6,21.59 102.23,20.95 106.42,20.95 107.31,20.06 107.31,10.79 106.68,10.16 105.41,10.16 104.78,9.53 R308.2
  Bottom 0.406: IC300.P$14 97.16,37.47 v97.16,28.57
N$18
  Bottom 0.61: IC300.P$15 97.53,40.64 98.42,41.54 98.42,57.47 96.04,59.85 75.8,59.85 73.03,62.62 73.03,75.68 71.22,77.48 M1.2
  Bottom 1.016: R305.1 69.01,77.63 M1.2
N$19
  Bottom 0.61: IC300.P$16 96.52,57.52 95.62,58.42 74.36,58.42 71.12,61.66 71.12,74.64 70.28,75.48 M1.3
  Bottom 1.016: R304.1 69.01,75.41 M1.3
N$20
  Top 1.27: D401.A 48.33,89.22 47.6,89.94 MCONE.2
  pour Bottom (no thermals): 60.96,95.25 60.96,88.27 54.29,88.27 54.29,92.39 46.67,92.39 46.67,95.25
N$21
  Top 0.406: IC300.P$21 83.82,56.89 84.72,57.78 106.42,57.78 107.31,56.89 S300.4
  Bottom 0.813: S300.4 R300.1
N$23
  Top 0.813: D100.C 138.43,48.9 | FUSE.P$3 138.43,47.62 | 138.43,45.09 Q100.S
  Top 1.016: Q100.S 141.6,43.81 | 141.6,43.81 ZD100.C | R101.1 144.78,42.92 143.88,43.81 141.6,43.81
  Top 3.81: 138.43,48.9 138.43,47.62 138.43,45.09
N$25
  Bottom 0.813: R313.2 88.9,49.95 88.9,52.07 | 88.9,52.07 IC300.P$19 | 88.9,52.07 C303.1
N$38
  Top 0.406: R206.2 115.04,36.83 116.84,35.03 116.84,29.21 118.11,27.94 122.41,27.94 123.83,26.52 S202.2
  Bottom 0.406: S202.1 123.83,20.95 | 123.83,20.95 S202.2 C203.1 | R202.1 123.83,20.95
N$39
  Top 0.406: R207.2 113.59,34.61 114.3,33.9 S203.2
  Bottom 0.406: S203.1 114.3,29.84 | 114.3,29.84 S203.2 C204.1 | R203.1 114.3,29.84
N$44  (via drill 0.5)
  Top 1.016: Q401.2 v60.01,78.58
  Bottom 0.61: R403.1 60.01,80.17
  Bottom 1.016: Q402.2 61.29,78.58 v60.01,78.58 60.01,80.17
N$45
  Top 1.016: Q100.G 141.6,38.73 | 141.6,38.73 ZD100.A | R101.2 144.78,39.37 144.15,38.73 141.6,38.73
  Bottom 0.813: R100.2 Q100.G
N$47
  Bottom 1.016: R404.1 60.01,81.92 R403.2 60.01,84.58 Q403.G
N$54
  Top 0.406: R204.2 111.12,29.11 111.12,27.45 109.7,26.04 105.41,26.04 104.78,25.4 S200.2
  Bottom 0.406: C201.1 S200.2 104.78,20.95 | R200.1 104.78,20.95 | 104.78,20.95 S200.1
N$62  (via drill 0.5)
  Top 1.016: Q401.1 v60.01,76.68 R402.1
  Bottom 1.016: v60.01,76.68 61.29,76.68 Q402.1
N$64
  Top 1.016: Q400.3 56.52,70.8 56.52,72.39 57.47,73.34 57.78,73.34 | 57.78,73.34 R401.1 | 57.78,73.34 60.01,73.34 R402.2
N$68
  Top 1.016: R400.1 57.78,68.1 59.05,68.1 | 59.05,68.1 60.01,68.1 | 60.01,68.1 C400.2 | Q400.1 59.05,69.69 59.05,68.1 | 60.01,68.1 60.62,68.1 61.12,68.61 D400.C
PGND  (via drill 0.5)
  Top 1.016: BOOST_CONE.8 30.48,8.26 | BOOST_CONE.7 32.38,8.26 | C402.- 36.83,97.47 | v51.43,88.26 52.07,88.26 52.07,97.47
  Top 1.93: 27.26,97.42 27.3,97.47 | 16.51,93.34 16.77,94.51 | 154.31,67.63 154.94,59.05
  Top 2.184: MD501.MGND2 MD501.MGND1 | MD501.MGND2 35.84,80.27 33.39,79.65 14.61,90.81 16.51,93.34 | MD501.MGND3 MD501.MGND2 | 71.02,2.86 71.12,19.05 71.12,19.29 68.82,21.58 MD500.MGND2 | MD500.MGND2 MD500.MGND3 | MD500.MGND2 MD500.MGND1 | MD502.MGND2 135.01,61.54 135.59,63.64 152.72,73.98 154.31,67.63 | MD502.MGND2 MD502.MGND1 | MD502.MGND2 MD502.MGND3
  Top 2.54: 30.54,2.86 BOOST_CONE.8 32.38,8.26 | 30.48,8.26 28.57,8.26
  Top 3.81: 149.86,54.13 153.61,54.13 154.82,55.3 154.94,59.05 154.94,59.28 arc37 143.16,94.51 140.93,97.47 52.07,97.47 36.83,97.47 27.3,97.47 18.88,97.47 16.77,94.51 arc35 2.54,49.89 arc35 16.07,6.73 18.57,2.86 30.54,2.86 71.02,2.86
  Bottom 1.016: BOOST_CONE.9 28.57,8.26 | R404.2 55.51,81.92 Q403.S
  Bottom 1.27: BOOST_CONE.7 32.38,8.26
  Bottom 2.54: 28.57,8.26 BOOST_CONE.8 | 32.38,8.26 31.11,8.26
  other vias: 53.34,88.26 52.38,88.26
  pour Bottom (no thermals): 37.78,95.25 37.78,90.81 34.29,90.81 34.29,95.25
  pour Top (no thermals): 34.29,95.89 34.26,92.39 37.78,92.39 37.78,95.89
  pour Bottom (no thermals): 53.66,91.76 50.8,91.76 50.8,82.87 56.52,82.87 56.52,87.63 53.66,87.63
  pour Top (no thermals): 53.98,98.74 50.8,98.74 50.8,87.31 53.98,87.31
PUSH
  Top 0.406: R204.1 107.95,29.53 | 107.95,29.53 C205.1 | IC300.P$10 83.82,39.47 85.83,37.47 101.97,37.47 102.87,36.57 102.87,31.11 103.5,30.48 107.59,30.48 107.95,30.12 107.95,29.53
PWM
  Top 1.016: R400.2 57.78,66.2 60.01,66.2 | 60.01,66.2 C400.1 | 60.01,66.2 64.76,66.2 66.67,64.29 66.67,61.45 67.95,60.17 74.04,60.17 76.2,58.01 IC300.P$24
SCK  (via drill 0.5, 0.6)
  Top 0.813: R307.1 39.42,24.29 DISP300.8 v39.42,41.91 v39.42,50.82 39.42,52.22 41.18,53.98 45.46,53.98 46.35,54.87 IC302.6 | U$30.3 36.83,41.93 v36.83,41.91
  Bottom 0.813: v39.42,50.82 76.43,50.82 78.74,48.51 IC300.P$8 | v36.83,41.91 v39.42,41.91
SDA  (via drill 0.5)
  Top 0.813: v37.92,44.43 37.92,52.53 40.64,55.24 44.45,55.24 45.09,55.88 IC302.5 | v37.92,44.43 DISP300.7 37.92,24.17 R306.1 | U$30.2 v37.92,44.43 | v50.8,44.45 v69.85,44.45
  Bottom 0.813: v37.92,44.43 38.08,44.45 v50.8,44.45 | IC300.P$7 76.2,42.44 74.19,44.45 v69.85,44.45
SENSOR
  Top 1.016: IC300.P$23 78.74,57.89 80.54,59.69 95.1,59.69 97.79,62.38 97.79,85.2 99.59,87 102.23,87 102.87,87.63 SENS_CONE.2
STRAIGHT
  Top 0.406: IC300.P$6 73.66,39.37 72.39,38.1 51.81,38.1 48.9,35.19 48.9,12.38 47.94,11.43 46.26,11.43 45.54,10.71 BOOST_CONE.2

### Text on the board
tNames: +B | Motor | Sig | GND | +5V | GND | 5V | +B | SDA | SCL | GND | CANL | CANH | DisCharge | IG | GND | GND | Roots | DisCharge | BATT | PGND | EN | !Done! | Chip | 5V | 3V3 | Kick | MainCircuit Ver.3.1